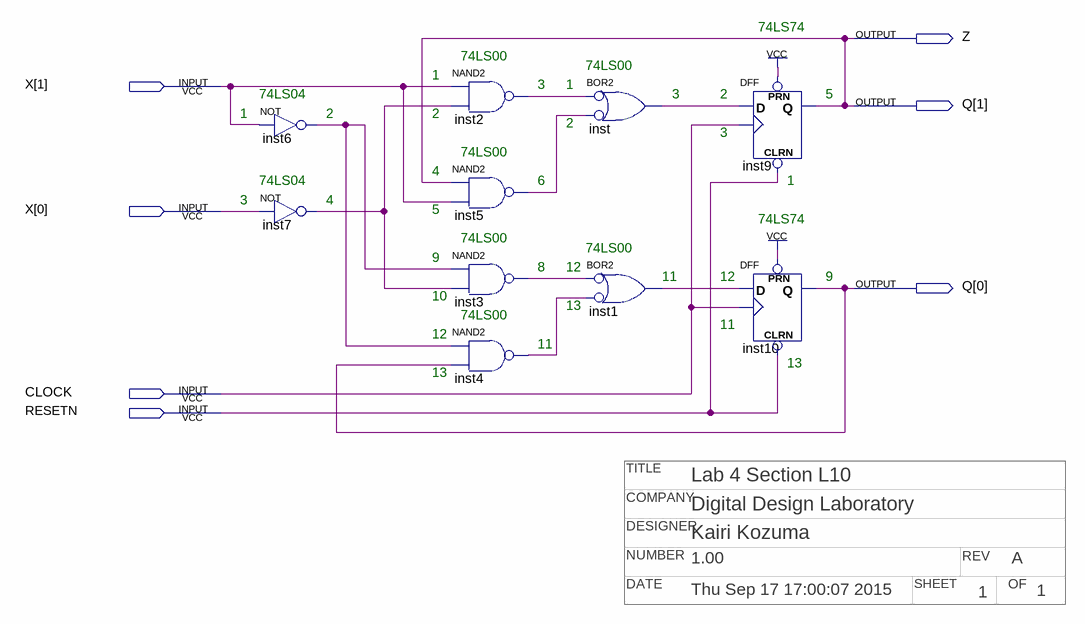
[diagram p0: schematic sheet]
// Quartus schematic sm_schematic.bdf as structural Verilog: 10 symbols, 7 pins
// Title block: TITLE: Lab 4 Section L10; COMPANY: Digital Design Laboratory; DESIGNER: Kairi Kozuma; NUMBER: 1.00; REV: A; DATE: Thu Sep 17 17:00:07 2015; SHEET: 1; OF: 1
module sm_schematic (
  input  [1:0] X,
  input  CLOCK,
  input  RESETN,
  output Z,
  output [1:0] Q
);

  wire inst1_out, inst2_out, inst3_out, inst4_out, inst5_out, inst6_out, inst7_out, inst_out;

  not inst6 (inst6_out, X[1]);
  not inst7 (inst7_out, X[0]);
  nand inst2 (inst2_out, X[1], inst7_out);
  nand inst5 (inst5_out, Q[1], X[1]);
  nand inst3 (inst3_out, inst6_out, inst7_out);
  nand inst4 (inst4_out, inst6_out, Q[0]);
  or inst (inst_out, ~inst2_out, ~inst5_out);  // BOR2
  or inst1 (inst1_out, ~inst3_out, ~inst4_out);  // BOR2
  DFF inst9 (.CLRN(RESETN), .CLK(CLOCK), .D(inst_out), .PRN(1'b1), .Q(Q[1]));
  DFF inst10 (.CLRN(RESETN), .CLK(CLOCK), .D(inst1_out), .PRN(1'b1), .Q(Q[0]));

  assign Z = Q[1];

  // Notes on the sheet:
  //   74LS74
  //   74LS00
  //   74LS00
  //   1
  //   3
  //   1
  //   74LS04
  //   3
  //   2
  //   5
  //   1
  //   2
  //   2
  //   2
  //   3
  //   74LS00
  //   4
  //   74LS04
  //   6
  //   1
  //   3
  //   4
  //   5
  //   74LS74
  //   74LS00
  //   74LS00
  //   9
  //   8
  //   12
  //   11
  //   12
  //   9
  //   10
  //   13
  //   74LS00
  //   11
  //   12
  //   11
  //   13
  //   13
endmodule
